# EAGLE design Nu_Multi (EAGLE 6.3)
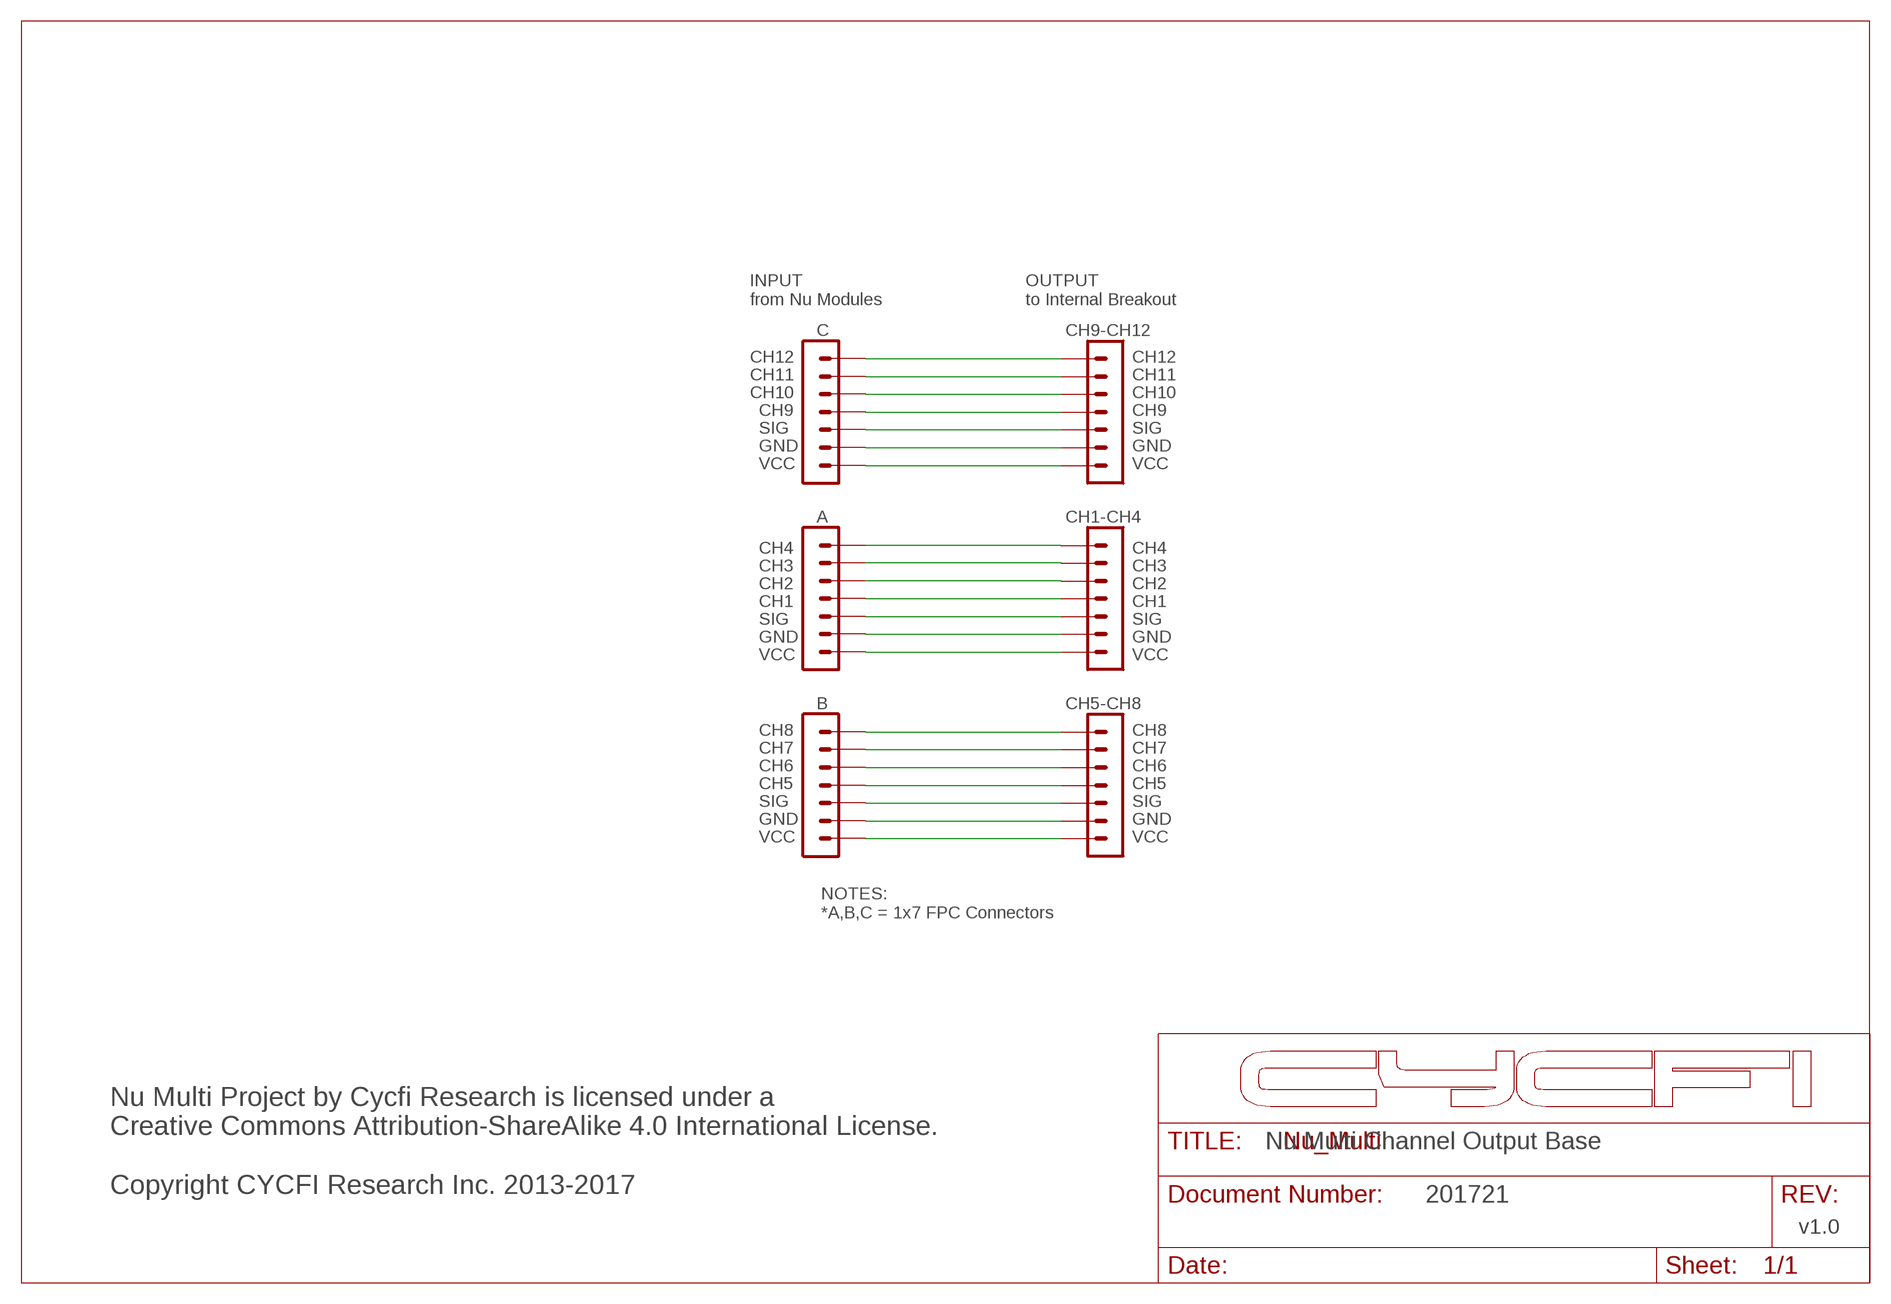
[diagram p0: schematic, sheet 1]

## Parts
H1  7P_ZIF_59453-071110EDHLF  [7P_ZIF_59453-071110EDHLF]
H2  7P_ZIF_59453-071110EDHLF  [7P_ZIF_59453-071110EDHLF]
H3  7P_ZIF_59453-071110EDHLF  [7P_ZIF_59453-071110EDHLF]
H4  7P_ZIF_59453-071110EDHLF  [7P_ZIF_59453-071110EDHLF]
H5  7P_ZIF_59453-071110EDHLF  [7P_ZIF_59453-071110EDHLF]
H6  7P_ZIF_59453-071110EDHLF  [7P_ZIF_59453-071110EDHLF]

## Nets
GND: H1.P$6 H2.P$6 H3.P$6 H4.P$6 H5.P$6 H6.P$6
N$1: H5.P$1 H6.P$1
N$2: H5.P$2 H6.P$2
N$3: H5.P$3 H6.P$3
N$4: H5.P$4 H6.P$4
N$5: H5.P$5 H6.P$5
N$7: H5.P$7 H6.P$7
N$8: H2.P$7 H4.P$7
N$10: H2.P$5 H4.P$5
N$11: H2.P$4 H4.P$4
N$12: H2.P$3 H4.P$3
N$13: H2.P$2 H4.P$2
N$14: H2.P$1 H4.P$1
N$15: H1.P$7 H3.P$7
N$17: H1.P$5 H3.P$5
N$18: H1.P$4 H3.P$4
N$19: H1.P$3 H3.P$3
N$20: H1.P$2 H3.P$2
N$21: H1.P$1 H3.P$1

## Notes on the sheet
- INPUT
  from Nu Modules
- OUTPUT
  to Internal Breakout
- C | CH9-CH12
- CH12 | CH12
- CH11 | CH11
- CH10 | CH10
- CH9 | CH9
- SIG | SIG
- GND | GND
- VCC | VCC
- A | CH1-CH4
- CH4 | CH4
- CH3 | CH3
- CH2 | CH2
- CH1 | CH1
- SIG | SIG
- GND | GND
- VCC | VCC
- B | CH5-CH8
- CH8 | CH8
- CH7 | CH7
- CH6 | CH6
- CH5 | CH5
- SIG | SIG
- GND | GND
- VCC | VCC
- NOTES:
  *A,B,C = 1x7 FPC Connectors
- Nu Multi Channel Output Base
- Nu Multi Project by Cycfi Research is licensed under a 
  Creative Commons Attribution-ShareAlike 4.0 International License. 
  
  Copyright CYCFI Research Inc. 2013-2017
- 201721
- v1.0

## Library data of the parts
H1-H6 = CYCFI_Con:7P_ZIF_59453-071110EDHLF

## Board
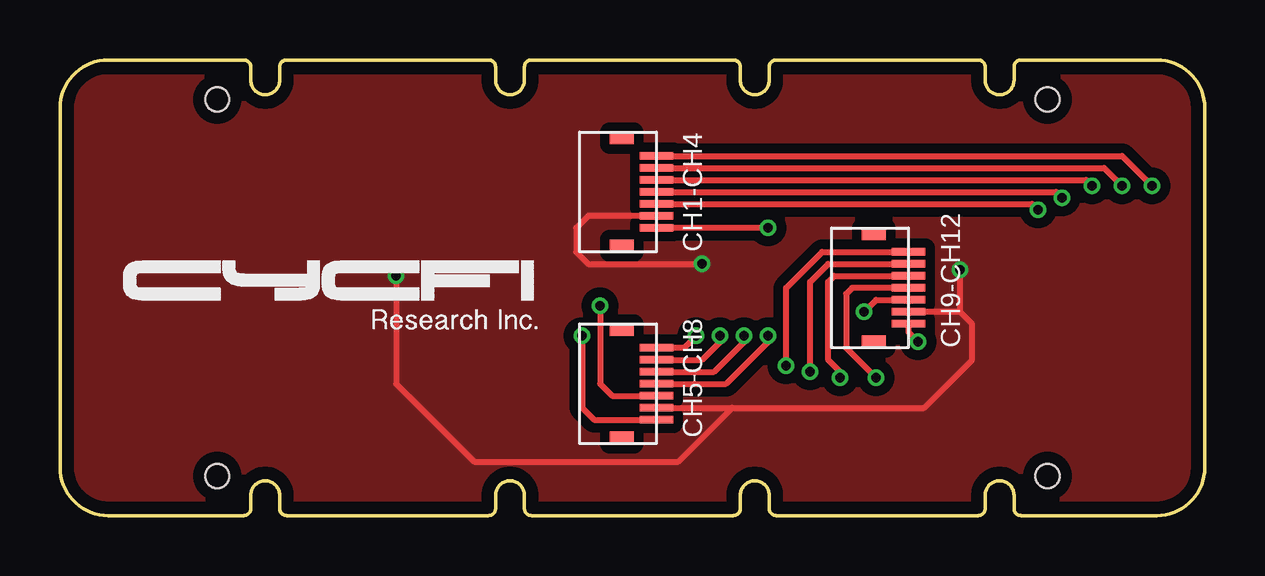
[diagram p1: board, top side]
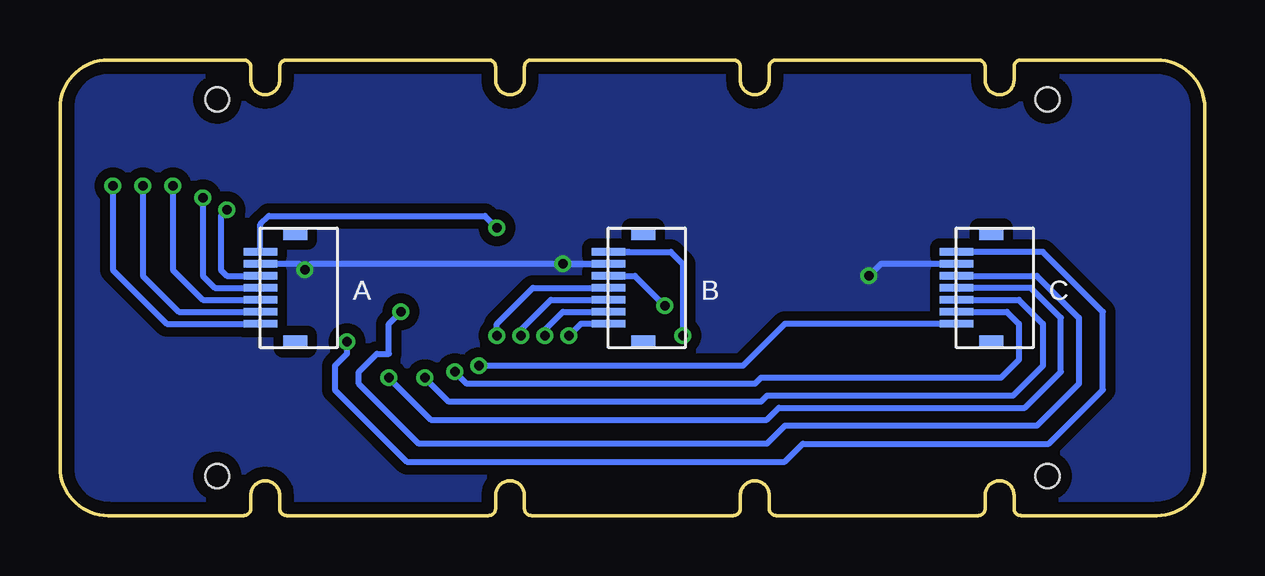
[diagram p2: board, bottom side, seen from below]

Size 47.7 x 19 mm. Coordinates in mm from the lower left corner, seen from the top.
Outline: 7.65,0 2,0 arc-90 0,2 0,17 arc-90 2,19 7.65,19 arc-90 7.95,18.7 7.95,18.15 arc90 8.55,17.55 arc90 9.15,18.15 9.15,18.7 arc-90 9.45,19 17.85,19 arc-90 18.15,18.7 18.15,18.15 arc90 18.75,17.55 arc90 19.35,18.15 19.35,18.7 arc-90 19.65,19 28.05,19 arc-90 28.35,18.7 28.35,18.15 arc90 28.95,17.55 arc90 29.55,18.15 29.55,18.7 arc-90 29.85,19 38.25,19 arc-90 38.55,18.7 38.55,18.15 arc90 39.15,17.55 arc90 39.75,18.15 39.75,18.7 arc-90 40.05,19 45.7,19 arc-90 47.7,17 47.7,2 arc-90 45.7,0 40.05,0 arc-90 39.75,0.3 39.75,0.85 arc90 39.15,1.45 arc90 38.55,0.85 38.55,0.3 arc-90 38.25,0 29.85,0 arc-90 29.55,0.3 29.55,0.85 arc90 28.95,1.45 arc90 28.35,0.85 28.35,0.3 arc-90 28.05,0 19.65,0 arc-90 19.35,0.3 19.35,0.85 arc90 18.75,1.45 arc90 18.15,0.85 18.15,0.3 arc-90 17.85,0 9.45,0 arc-90 9.15,0.3 9.15,0.85 arc90 8.55,1.45 arc90 7.95,0.85 7.95,0.3 arc-90 7.65,0
Copper layers (1*16): Top 0.035mm / dielectric 1.6mm / Bottom 0.035mm
Design rules "Elecrow_2-layer_PCB_eagle_rule": minimum track width 6mil, minimum drill 12mil, track to track 6mil, track to pad 8mil, pad to pad 12mil, via to via 12mil, smd to smd 0mil, copper to edge 20mil, drill to drill 10mil, minimum pad ring 6mil, minimum via ring 6mil, stop-mask expansion 0mil, vias tented up to drill 100mil, thermal gap 10mil
Holes 1 mm at 6.55,17.35 6.55,1.65 41.15,17.35 41.15,1.65

### Footprints (pad centres in the part's own frame; a part is rotated, then mirrored left to right if it is on the bottom)
7P_ZIF_59453-071110EDHLF = smd 0.3 x 1.4: P$1 -1.5,1.6; P$2 -1,1.6; P$3 -0.5,1.6; P$4 0,1.6; P$5 0.5,1.6; P$6 1,1.6; P$7 1.5,1.6 | smd 0.52 x 1: ST1 -2.24,0.15; ST2 2.24,0.15

### Placement (x,y rotation side)
H1  23.25,13.5 270 top
H2  23.25,9.5 90 bottom
H3  37.75,9.5 90 bottom
H4  23.25,5.5 270 top
H5  8.75,9.5 90 bottom
H6  33.75,9.5 270 top

### Tracks (layer width: path | path; a pad name or v marks a point on that pad's centre or on a via)
GND  (via drill 0.4)
  Top 0.254: H4.P$6 28,4.5 | 28,4.5 36,4.5 38,6.5 38,8 37.5,8.5 | 37.5,8.5 H6.P$6 | 37.5,8.5 v37.5,10.25 | H1.P$6 22,12.5 21.5,12 21.5,11 22,10.5 v26.75,10.5 | v14,10 14,5.5 17.25,2.25 25.75,2.25 28,4.5
  Bottom 0.254: H3.P$6 37.75,10.5 v37.5,10.25 37.25,10.5 H2.P$6 v26.75,10.5 | H5.P$6 13.5,10.5 v14,10
  pour Bottom (isolate 0.406): 2,19 45.7,19 arc-90 47.7,17 47.7,2 arc-90 45.7,0 2,0 arc-90 0,2 0,17 arc-90
  pour Top (isolate 0.406): 2,19 45.7,19 arc-90 47.7,17 47.7,2 arc-90 45.7,0 2,0 arc-90 0,2 0,17 arc-90
N$1  (via drill 0.4)
  Top 0.254: v30.25,6.25 30.25,9.5 31.75,11 H6.P$1
  Bottom 0.254: H5.P$1 17.5,8 19.25,6.25 v30.25,6.25
N$2  (via drill 0.4)
  Top 0.254: v31.25,6 31.25,9.75 32,10.5 H6.P$2
  Bottom 0.254: H5.P$2 8.25,8.5 7.75,8 7.75,6.5 8.5,5.75 18.5,5.75 18.75,5.5 30.75,5.5 v31.25,6
N$3  (via drill 0.4)
  Top 0.254: v32.5,5.75 32.5,6 32,6.5 32,9.75 32.25,10 H6.P$3
  Bottom 0.254: H5.P$3 7.75,9 6.75,8 6.75,6.25 8,5 18.25,5 18.5,4.75 31.5,4.75 v32.5,5.75
N$4  (via drill 0.4)
  Top 0.254: H6.P$4 33,9.5 32.75,9.25 32.75,7 v34,5.75
  Bottom 0.254: v34,5.75 32.25,4 18.25,4 17.75,4.5 7.5,4.5 6,6 6,8.25 7.25,9.5 H5.P$4
N$5  (via drill 0.4)
  Top 0.254: v33.5,8.5 34,9 H6.P$5
  Bottom 0.254: H5.P$5 7,10 5.25,8.25 5.25,5.5 7,3.75 17.5,3.75 18.25,3 32.75,3 35.25,5.5 35.25,6 34.5,6.75 34,6.75 34,8 v33.5,8.5
N$7  (via drill 0.4)
  Top 0.254: H6.P$7 35.35,7.65 v35.75,7.25
  Bottom 0.254: v35.75,7.25 35.75,6.75 36.25,6.25 36.25,5.25 33.25,2.25 17.5,2.25 16.75,3 6.5,3 4.25,5.25 4.25,8.5 6.75,11 H5.P$7
N$8  (via drill 0.4)
  Top 0.254: v21.75,7.5 21.75,4.5 22.25,4 H4.P$7
  Bottom 0.254: 24,11 H2.P$7 22.25,11 21.75,10.5 v21.75,7.5
N$10  (via drill 0.4)
  Top 0.254: v22.5,8.75 22.5,5.5 23,5 H4.P$5
  Bottom 0.254: H2.P$5 23.75,10 v22.5,8.75
N$11  (via drill 0.4)
  Top 0.254: H4.P$4 27.75,5.5 29.5,7.25 v29.5,7.5
  Bottom 0.254: v29.5,7.5 29.5,8 28,9.5 H2.P$4
N$12  (via drill 0.4)
  Top 0.254: H4.P$3 27.25,6 28.5,7.25 v28.5,7.5
  Bottom 0.254: v28.5,7.5 28.5,7.75 27.25,9 H2.P$3
N$13  (via drill 0.4)
  Top 0.254: H4.P$2 26.75,6.5 27.5,7.25 v27.5,7.5
  Bottom 0.254: v27.5,7.5 27.5,7.75 26.75,8.5 H2.P$2
N$14  (via drill 0.4)
  Top 0.254: v26.5,7.5 26,7 H4.P$1
  Bottom 0.254: H2.P$1 26,8 v26.5,7.5
N$15  (via drill 0.4)
  Top 0.254: v29.5,12 H1.P$7
  Bottom 0.254: H3.P$7 39.35,12.15 39,12.5 30,12.5 v29.5,12
N$17  (via drill 0.4)
  Top 0.254: H1.P$5 40.5,13 v40.75,12.75
  Bottom 0.254: v40.75,12.75 41,12.5 41,10.25 40.75,10 H3.P$5
N$18  (via drill 0.4)
  Top 0.254: H1.P$4 41.5,13.5 v41.75,13.25
  Bottom 0.254: v41.75,13.25 41.75,10 41.25,9.5 H3.P$4
N$19  (via drill 0.4)
  Top 0.254: H1.P$3 42.75,14 v43,13.75
  Bottom 0.254: v43,13.75 43,10.25 41.75,9 H3.P$3
N$20  (via drill 0.4)
  Top 0.254: H1.P$2 43.5,14.5 v44.25,13.75
  Bottom 0.254: v44.25,13.75 44.25,10 42.75,8.5 H3.P$2
N$21  (via drill 0.4)
  Top 0.254: H1.P$1 44.25,15 v45.5,13.75
  Bottom 0.254: v45.5,13.75 45.5,10.25 43.25,8 H3.P$1

### Text on the board
tNames: CH1-CH4 | CH9-CH12 | CH5-CH8
bNames: C | B | A
_tNames: CH1-CH4 | CH9-CH12 | CH5-CH8
_bNames: C | B | A